# EAGLE design transmitter_b (EAGLE 5.09)
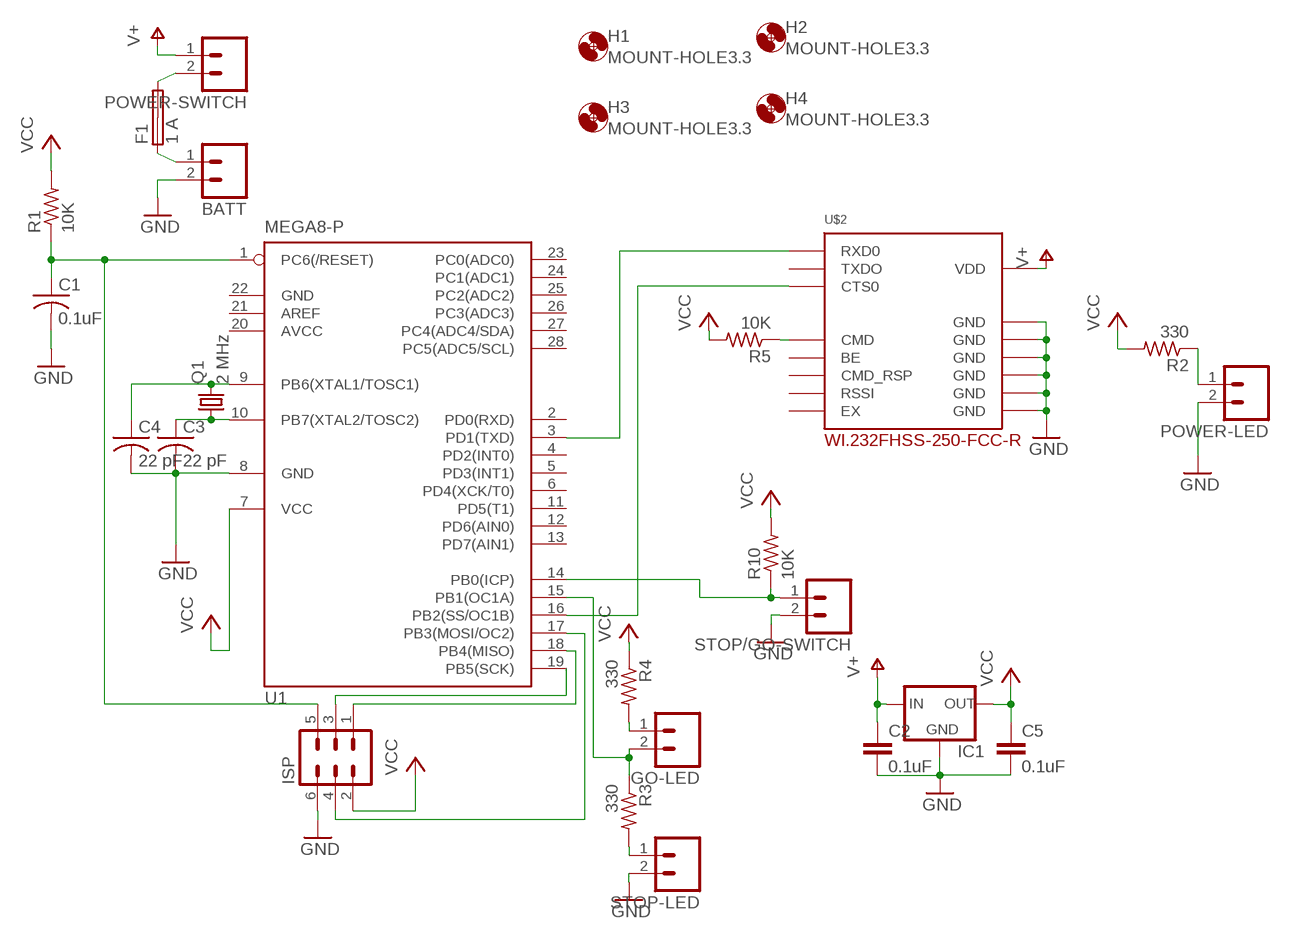
[diagram p0: schematic, sheet 1]

## Parts
BATT  M02POLAR  [MOLEX-1X2]
C1  0.1uF  C-US050-055X075  [C050-055X075]
C2  0.1uF  C2.5/2  [C2.5-2]
C3  22 pF  C-US025-025X050  [C025-025X050]
C4  22 pF  C-US025-025X050  [C025-025X050]
C5  0.1uF  C2.5/2  [C2.5-2]
F1  1 A  SHK20Q  [SHK20Q]
GO-LED  M02POLAR  [MOLEX-1X2]
H1  MOUNT-HOLE3.3  [3,3]
H2  MOUNT-HOLE3.3  [3,3]
H3  MOUNT-HOLE3.3  [3,3]
H4  MOUNT-HOLE3.3  [3,3]
IC1  78XXS  [78XXS]
ISP  MA03-2  [MA03-2]
POWER-LED  M02POLAR  [MOLEX-1X2]
POWER-SWITCH  M02POLAR  [MOLEX-1X2]
Q1  2 MHz  CRYSTALHC49S  [HC49/S]
R1  10K  R-US_0207/10  [0207/10]
R2  330  R-US_0207/10  [0207/10]
R3  330  R-US_0207/10  [0207/10]
R4  330  R-US_0207/10  [0207/10]
R5  10K  R-US_0207/10  [0207/10]
R10  10K  R-US_0207/10  [0207/10]
STOP-LED  M02POLAR  [MOLEX-1X2]
STOP/GO-SWITCH  M02POLAR  [MOLEX-1X2]
U1  MEGA8-P  [DIL28-3]
U$2  WI.232FHSS-250-FCC-R  [RADIOTRONIX-EVM]

## Nets
GND: BATT.2 C1.2 C2.2 C3.2 C4.2 C5.2 IC1.GND ISP.6 POWER-LED.2 STOP-LED.2 STOP/GO-SWITCH.2 U1.8(GND) U$2.JP1-1(GND) U$2.JP1-2(GND) U$2.JP1-11(GND) U$2.JP1-12(GND) U$2.JP2-11(GND) U$2.JP2-12(GND)
N$1: C3.1 Q1.1 U1.10(PB7(XTAL2/TOSC2))
N$2: C4.1 Q1.2 U1.9(PB6(XTAL1/TOSC1))
N$3: C1.1 ISP.5 R1.1 U1.1(PC6(/RESET))
N$4: F1.2A POWER-SWITCH.2
N$5: BATT.1 F1.1A
N$6: R10.1 STOP/GO-SWITCH.1 U1.14(PB0(ICP))
N$7: R3.2 STOP-LED.1
N$8: GO-LED.1 R4.2
N$9: GO-LED.2 R3.1 U1.15(PB1(OC1A))
N$10: R5.1 U$2.JP2-5(CMD)
N$11: U1.3(PD1(TXD)) U$2.JP2-2(RXD0)
N$12: U1.16(PB2(SS/OC1B)) U$2.JP2-4(CTS0)
N$14: ISP.1 U1.18(PB4(MISO))
N$28: POWER-LED.1 R2.1
N$31: ISP.3 U1.19(PB5(SCK))
N$33: ISP.4 U1.17(PB3(MOSI/OC2))
V+: C2.1 IC1.IN POWER-SWITCH.1 U$2.JP2-1(VDD)
VCC: C5.1 IC1.OUT ISP.2 R1.2 R2.2 R4.1 R5.2 R10.2 U1.7(VCC)
Unconnected: F1.1B F1.2B U1.2(PD0(RXD)) U1.4(PD2(INT0)) U1.5(PD3(INT1)) U1.6(PD4(XCK/T0)) U1.11(PD5(T1)) U1.12(PD6(AIN0)) U1.13(PD7(AIN1)) U1.21(AREF) U1.23(PC0(ADC0)) U1.24(PC1(ADC1)) U1.25(PC2(ADC2)) U1.26(PC3(ADC3)) U1.27(PC4(ADC4/SDA)) U1.28(PC5(ADC5/SCL)) U$2.JP1-3(BE) U$2.JP1-4(CMD_RSP) U$2.JP1-5(RSSI) U$2.JP1-6(EX) U$2.JP2-3(TXDO)

## Power pins joined to a net without a drawn wire
AVCC: U1.20(AVCC)
GND: U1.22(GND)

## Library data of the parts
BATT GO-LED POWER-LED POWER-SWITCH STOP-LED STOP/GO-SWITCH = SparkFun:M02: Header 2 Standard 2-pin 0.1" header. Use with straight break away headers (SKU : PRT-00116), right angle break away headers (PRT-00553), swiss pins (PRT-00743), machine pins (PRT-00117), and female headers (PRT-00115). Molex polarized connector foot print use with SKU : PRT-08233 with associated crimp pins and housings.
C1 C3 C4 = resistor:C-US: CAPACITOR, American symbol
C2 C5 = capacitor-wima:C: CAPACITOR naming: grid - package width
F1 = fuse:SHK20Q: FUSE HOLDER 5 x 20 mm, SH contact, E1207 Buerklin 64G6061
H1-H4 = holes:MOUNT-HOLE: MOUNTING HOLE with drill center marker
IC1 = v-reg:78XXS: VOLTAGE REGULATOR
ISP = con-lstb:MA03-2: PIN HEADER
Q1 = crystal:CRYSTAL: CRYSTAL
R1-R5 R10 = resistor:R-US_: RESISTOR, American symbol
U1 = atmel:MEGA8-P: MICROCONTROLLER 8 Kbytes FLASH, 1 kbytes SRAM, 512 bytes EEPROM, USART, 4-channel 10 bit ADC, 2-channel 8 bit ADC Pin compatible with Atmega48, ATMega88, ATMega168 Source: avr.lbr
U$2 = chicagoedt:WI.232FHSS-250-FCC-R: 902 - 928 MHz FCC approved Wi.232FHSS-250-R modules with reverse SMA connector

## Board
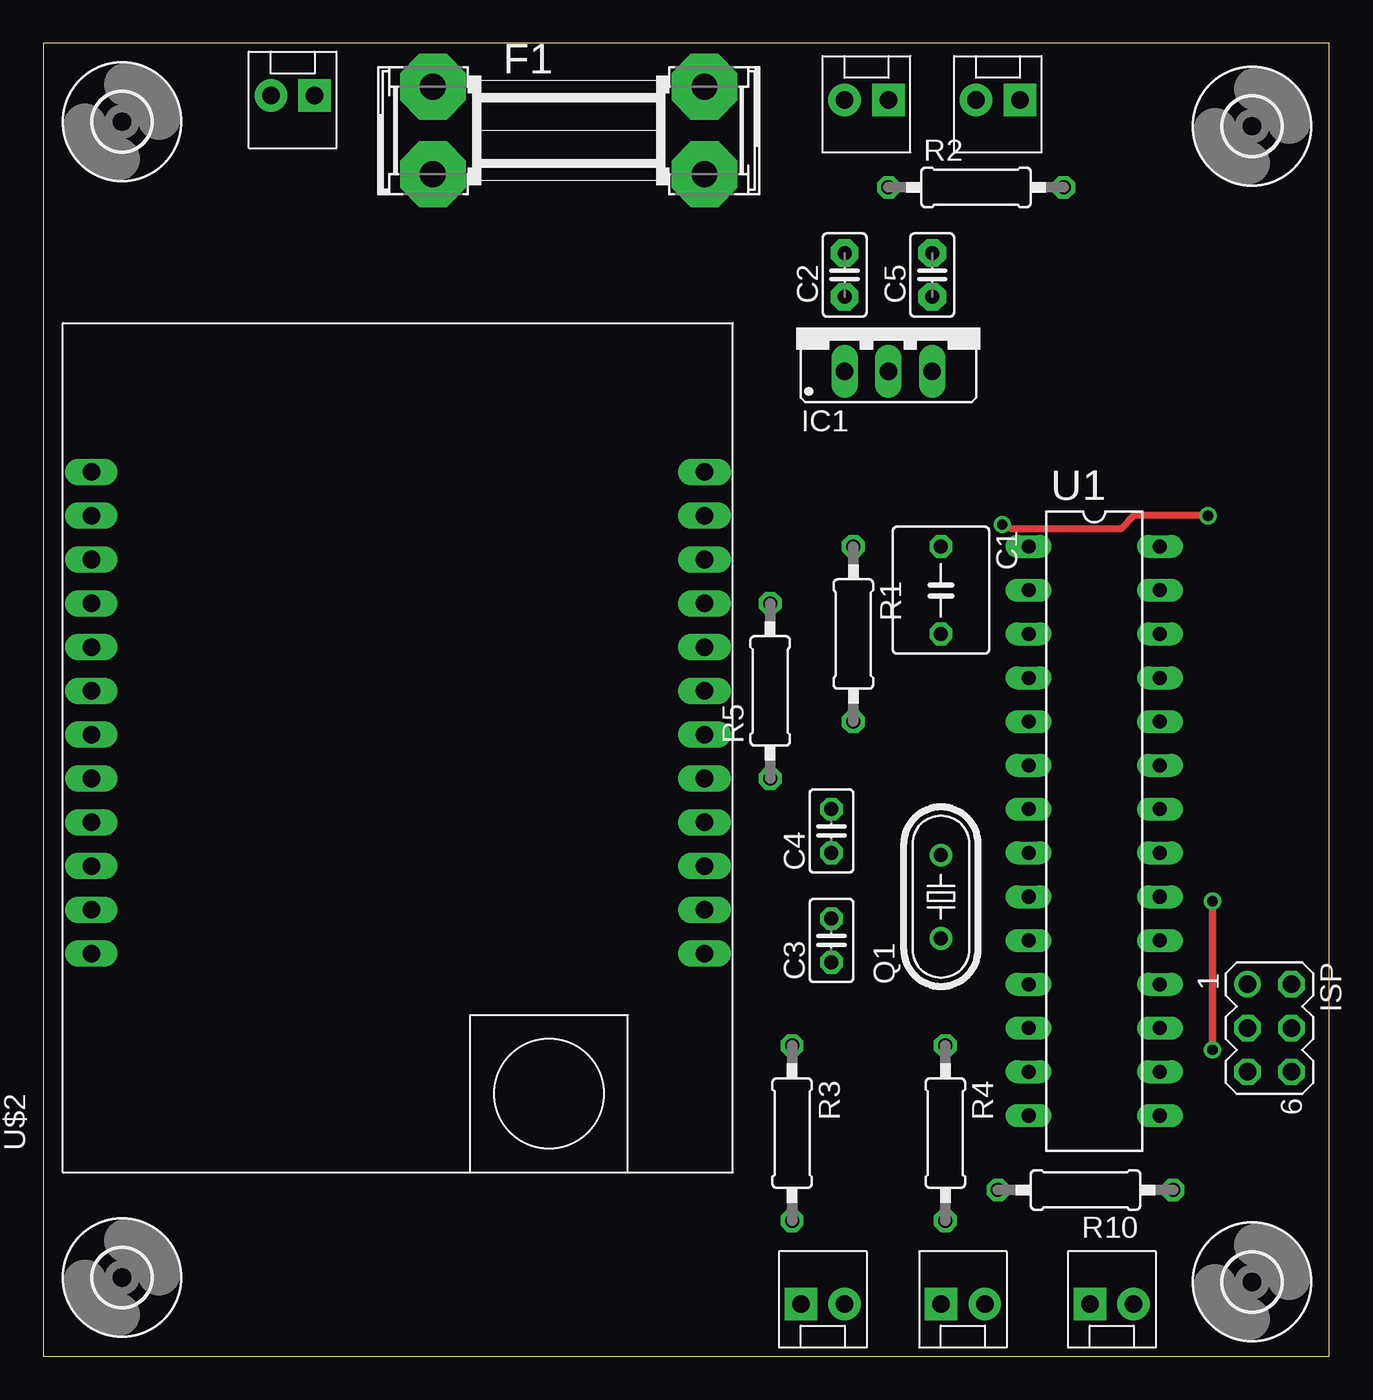
[diagram p1: board, top side]
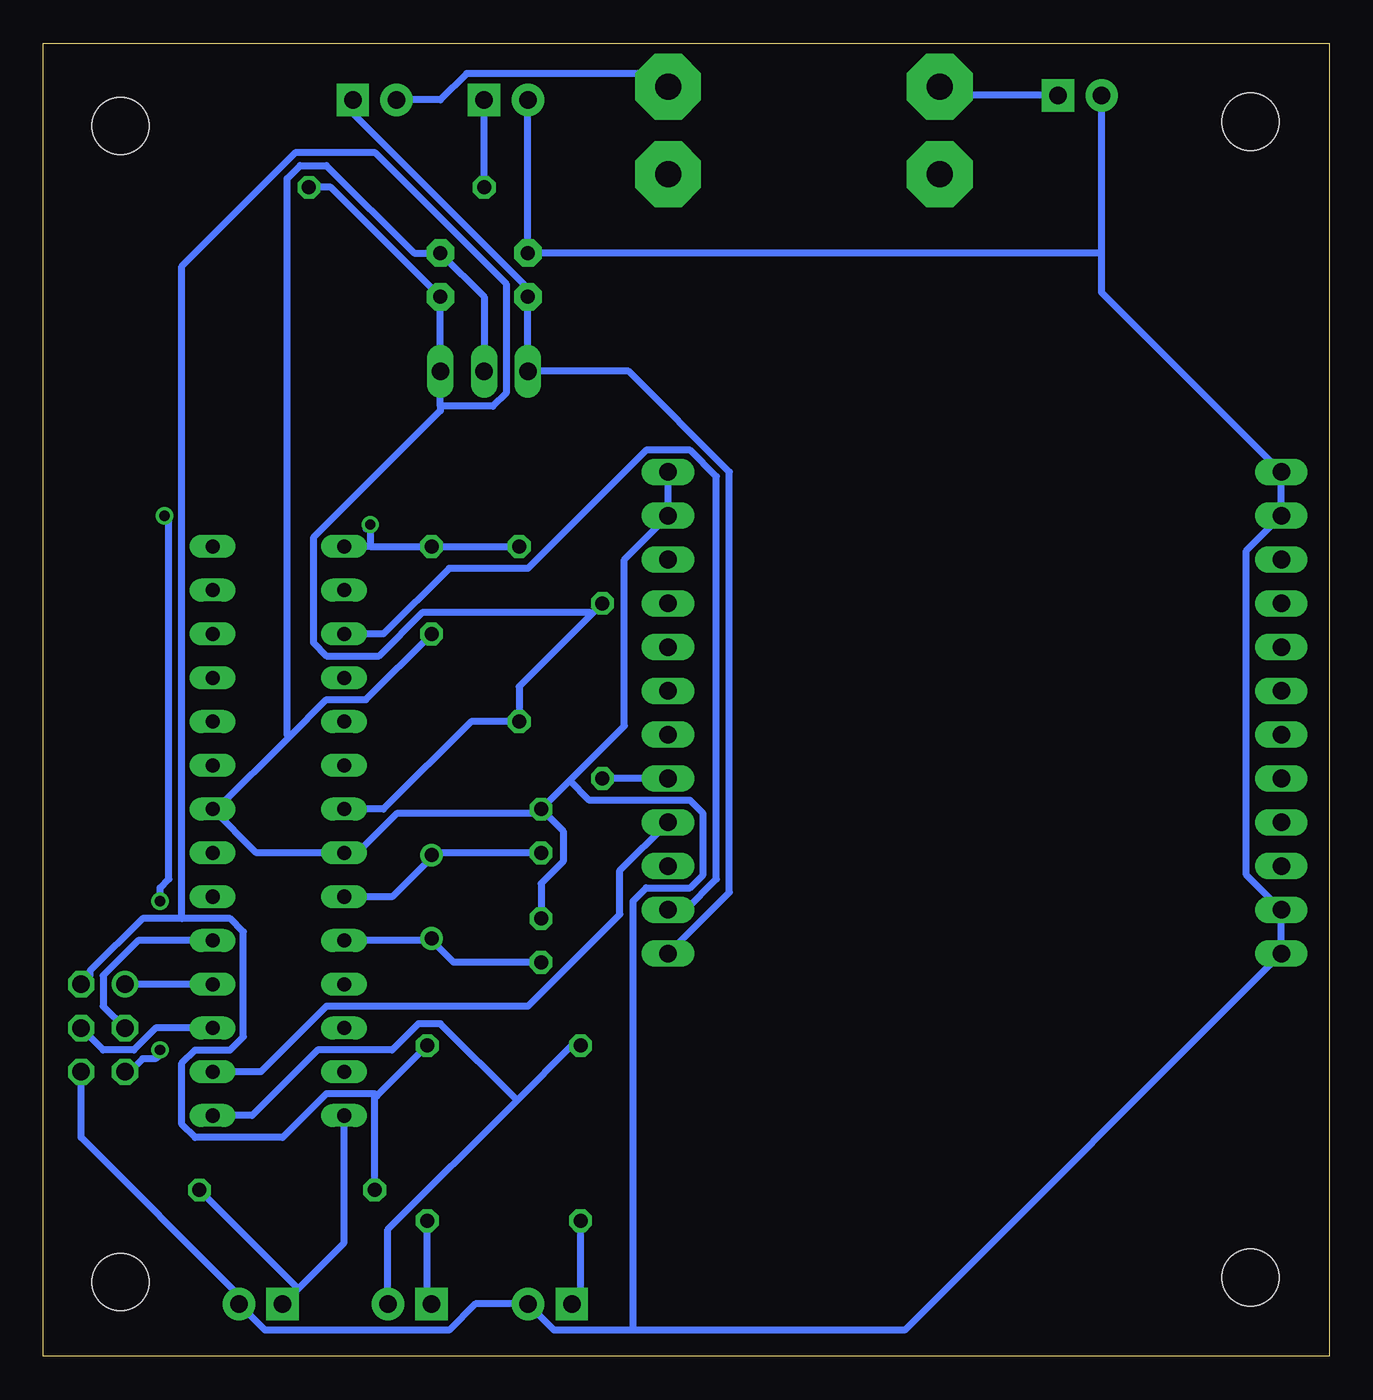
[diagram p2: board, bottom side, seen from below]

Size 74.6 x 76.19 mm. Coordinates in mm from the lower left corner, seen from the top.
Outline: 0,0 74.6,0 74.6,76.19 0,76.19 0,0
Copper layers (1*16): Top 0.035mm / dielectric 1.5mm / Bottom 0.035mm
Design rules "default *": minimum track width 16mil, minimum drill 24mil, track to track 10mil, track to pad 10mil, pad to pad 10mil, via to via 8mil, smd to smd 8mil, copper to edge 40mil, drill to drill 8mil, minimum pad ring 10mil, minimum via ring 8mil, stop-mask expansion 4mil, vias tented up to drill 0mil, thermal gap 10mil

### Footprints (pad centres in the part's own frame; a part is rotated, then mirrored left to right if it is on the bottom)
MOLEX-1X2 = drill 1.016 pad 1.88 square: 1 0,0 | drill 1.016 pad 1.88 round: 2 2.54,0
C050-055X075 = drill 0.813 octagon: 1 -2.54,0; 2 2.54,0
C2.5-2 = drill 0.813 pad 1.6 octagon: 1 -1.27,0; 2 1.27,0
C025-025X050 = drill 0.813 octagon: 1 -1.27,0; 2 1.27,0
SHK20Q = drill 1.5 pad 3.81 octagon: 1A -7.874,2.54; 1B -7.874,-2.54; 2A 7.874,2.54; 2B 7.874,-2.54
3,3 = hole 3.3: 0,0
78XXS = drill 1.016 long: GND 0,-2.54; IN -2.54,-2.54; OUT 2.54,-2.54
MA03-2 = drill 1.016 round: 1 -2.54,-1.27 | drill 1.016 octagon: 2 -2.54,1.27; 3 0,-1.27; 4 0,1.27; 5 2.54,-1.27; 6 2.54,1.27
HC49/S = drill 0.813 round: 1 -2.413,0; 2 2.413,0
0207/10 = drill 0.813 octagon: 1 -5.08,0; 2 5.08,0
DIL28-3 = drill 0.813 long: 1 -16.51,-3.81; 2 -13.97,-3.81; 3 -11.43,-3.81; 4 -8.89,-3.81; 5 -6.35,-3.81; 6 -3.81,-3.81; 7 -1.27,-3.81; 8 1.27,-3.81; 9 3.81,-3.81; 10 6.35,-3.81; 11 8.89,-3.81; 12 11.43,-3.81; 13 13.97,-3.81; 14 16.51,-3.81; 15 16.51,3.81; 16 13.97,3.81; 17 11.43,3.81; 18 8.89,3.81; 19 6.35,3.81; 20 3.81,3.81; 21 1.27,3.81; 22 -1.27,3.81; 23 -3.81,3.81; 24 -6.35,3.81; 25 -8.89,3.81; 26 -11.43,3.81; 27 -13.97,3.81; 28 -16.51,3.81
RADIOTRONIX-EVM = drill 1.016 long: JP1-1 -13.97,17.78; JP1-2 -11.43,17.78; JP1-3 -8.89,17.78; JP1-4 -6.35,17.78; JP1-5 -3.81,17.78; JP1-6 -1.27,17.78; JP1-7 1.27,17.78; JP1-8 3.81,17.78; JP1-9 6.35,17.78; JP1-10 8.89,17.78; JP1-11 11.43,17.78; JP1-12 13.97,17.78; JP2-1 -13.97,-17.78; JP2-2 -11.43,-17.78; JP2-3 -8.89,-17.78; JP2-4 -6.35,-17.78; JP2-5 -3.81,-17.78; JP2-6 -1.27,-17.78; JP2-7 1.27,-17.78; JP2-8 3.81,-17.78; JP2-9 6.35,-17.78; JP2-10 8.89,-17.78; JP2-11 11.43,-17.78; JP2-12 13.97,-17.78

### Placement (x,y rotation side)
BATT  15.75,73.15 180 top
C1  52.07,44.45 270 top
C2  46.48,62.74 90 top
C3  45.72,24.13 90 top
C4  45.72,30.48 90 top
C5  51.56,62.74 90 top
F1  30.48,71.12 0 top
GO-LED  52.07,3.05 0 top
H1  4.57,71.63 0 top
H2  4.57,4.57 0 top
H3  70.1,71.37 0 top
H4  70.1,4.32 0 top
IC1  49.02,59.69 0 top
ISP  71.12,19.05 270 top
POWER-LED  49.02,72.9 180 top
POWER-SWITCH  56.64,72.9 180 top
Q1  52.07,26.67 90 top
R1  46.99,41.91 270 top
R2  54.1,67.82 0 top
R3  43.43,12.95 270 top
R4  52.32,12.95 270 top
R5  42.16,38.61 90 top
R10  60.45,9.65 180 top
STOP-LED  43.94,3.05 0 top
STOP/GO-SWITCH  60.71,3.05 0 top
U1  60.96,30.48 270 top
U$2  20.57,37.34 90 top

### Tracks (layer width: path | path; a pad name or v marks a point on that pad's centre or on a via)
GND
  Bottom 0.406: U$2.JP2-12 U$2.JP2-11 40.89,46.23 40.89,36.58 44.07,33.4 | C3.2 45.72,27.43 44.45,28.7 44.45,30.48 C4.2 | 44.07,33.4 C4.2 | IC1.GND 49.02,61.47 C5.2 53.09,64.01 58.17,69.09 59.69,69.09 60.45,68.33 60.45,36.07 60.33,35.94 | C1.2 55.88,38.1 58.17,38.1 60.33,35.94 | 60.33,35.94 64.52,31.75 U1.22 62.23,29.21 U1.8 56.39,29.21 54.1,31.5 45.72,31.5 C4.2 | ISP.6 72.39,12.7 63.25,3.56 STOP/GO-SWITCH.2 61.72,1.52 51.05,1.52 49.53,3.05 STOP-LED.2 44.96,1.52 40.39,1.52 | POWER-LED.2 C2.2 13.21,64.01 | 13.21,64.01 13.21,61.72 U$2.JP1-12 U$2.JP1-11 4.83,46.74 4.83,27.94 U$2.JP1-2 U$2.JP1-1 24.64,1.52 40.39,1.52 | 13.21,64.01 BATT.2 | 40.39,1.52 40.39,26.42 39.62,27.18 37.08,27.18 36.32,27.94 36.32,31.5 37.08,32.26 42.93,32.26 44.07,33.4
N$1
  Bottom 0.406: C3.1 50.8,22.86 52.07,24.13 | 52.07,24.13 U1.10 | 52.07,24.13 Q1.1
N$2
  Bottom 0.406: C4.1 52.07,29.21 Q1.2 52.07,28.96 54.36,26.67 U1.9
N$3  (via drill 0.6)
  Top 0.406: v67.82,17.78 v67.82,26.42 | v55.63,48.26 55.88,48.26 56.13,48.01 62.48,48.01 63.25,48.77 v67.56,48.77
  Bottom 0.406: R1.1 C1.1 55.63,46.99 | 55.63,46.99 U1.1 | 67.69,17.65 68.07,17.27 68.83,17.27 69.6,16.51 ISP.5 | 67.69,17.65 67.56,17.78 | v67.82,26.42 67.82,27.18 67.31,27.69 67.31,48.77 v67.56,48.77 | 67.69,17.65 v67.82,17.78 | 55.88,48.01 v55.63,48.26 55.63,46.99
N$4
  Bottom 0.406: POWER-SWITCH.2 51.56,72.9 50.04,74.42 39.12,74.42 F1.2A
N$5
  Bottom 0.406: BATT.1 22.1,73.15 F1.1A
N$6
  Bottom 0.406: U1.14 57.15,6.6 59.82,3.94 | STOP/GO-SWITCH.1 59.82,3.94 | 59.82,3.94 R10.1
N$7
  Bottom 0.406: R3.2 43.43,3.56 STOP-LED.1
N$8
  Bottom 0.406: R4.2 52.32,3.3 GO-LED.1
N$9
  Bottom 0.406: R3.1 43.94,18.03 47.12,14.86 | 47.12,14.86 54.61,7.37 GO-LED.2 | U1.15 62.48,13.97 58.67,17.78 54.36,17.78 52.83,19.3 51.56,19.3 47.12,14.86
N$10
  Bottom 0.406: U$2.JP2-5 R5.1
N$11
  Bottom 0.406: U1.3 54.86,41.91 51.05,45.72 46.48,45.72 39.62,52.58 37.08,52.58 35.56,51.05 35.56,27.69 37.34,25.91 U$2.JP2-2
N$12
  Bottom 0.406: U1.16 61.98,16.51 58.17,20.32 46.48,20.32 41.15,25.65 41.15,28.19 U$2.JP2-4
N$14
  Bottom 0.406: U1.18 ISP.1
N$28
  Bottom 0.406: R2.1 POWER-LED.1
N$31
  Bottom 0.406: U1.19 69.09,24.13 71.12,22.1 71.12,20.32 ISP.3
N$33
  Bottom 0.406: U1.17 68.07,19.05 69.34,17.78 71.12,17.78 ISP.4
V+
  Bottom 0.406: U$2.JP2-1 34.8,26.92 34.8,51.31 40.64,57.15 IC1.IN C2.1 46.48,61.98 56.64,72.14 POWER-SWITCH.1
VCC
  Bottom 0.406: R10.2 55.37,14.99 55.24,15.11 | 55.24,15.11 R4.1 | ISP.2 71.88,22.1 71.88,22.35 68.83,25.4 66.55,25.4 | 66.55,25.4 63.75,25.4 62.99,24.64 62.99,18.54 63.75,17.78 65.79,17.78 66.55,17.02 66.55,13.46 65.79,12.7 60.71,12.7 58.17,15.24 55.37,15.24 55.24,15.11 | R2.2 57.91,67.82 C5.1 IC1.OUT 51.56,55.12 | 42.8,43.05 R5.2 | 42.8,43.05 46.99,38.86 R1.2 49.78,36.83 54.86,31.75 U1.7 | 51.56,55.12 51.56,54.86 58.93,47.5 58.93,41.4 58.17,40.64 55.12,40.64 52.58,43.18 42.93,43.18 42.8,43.05 | 66.55,25.4 66.55,63.25 59.94,69.85 55.37,69.85 47.75,62.23 47.75,55.88 48.51,55.12 51.56,55.12